# EAGLE schematic irwin (EAGLE 7.6.0)
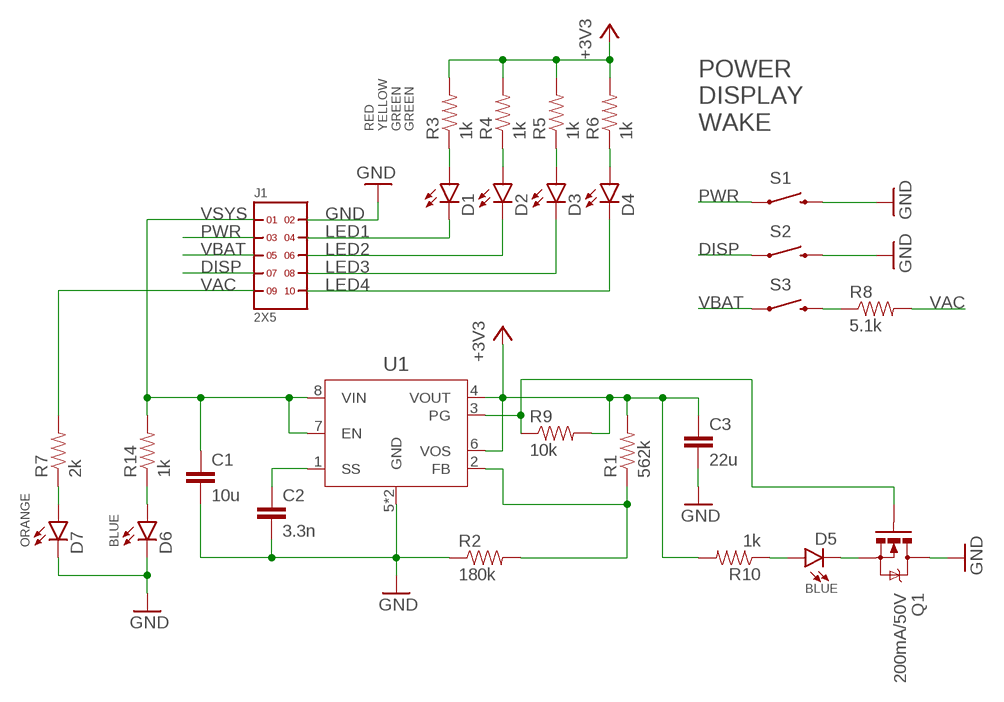
[diagram p0: schematic, sheet 1]

## Parts
C1  10u  CAP1206  [1206]
C2  3.3n  CAP1206  [1206]
C3  22u  CAP1206  [1206]
D1  LED1206  [LED-1206]
D2  LED1206  [LED-1206]
D3  LED1206  [LED-1206]
D4  LED1206  [LED-1206]
D5  LED1206  [LED-1206]
D6  LED1206  [LED-1206]
D7  LED1206  [LED-1206]
J1  2X5  [2X5]
Q1  200mA/50V  MOSFET-NCHANNELBSS138  [SOT23-3]
R1  562k  RESISTOR0805-RES  [0805]
R2  180k  RESISTOR0805-RES  [0805]
R3  1k  RESISTOR1206  [1206]
R4  1k  RESISTOR1206  [1206]
R5  1k  RESISTOR1206  [1206]
R6  1k  RESISTOR1206  [1206]
R7  2k  RESISTOR1206  [1206]
R8  5.1k  RESISTOR0805-RES  [0805]
R9  10k  RESISTOR0805-RES  [0805]
R10  1k  RESISTOR1206  [1206]
R14  1k  RESISTOR1206  [1206]
S1  SWITCH-MOMENTARY-2PTH  [TACTILE-PTH]
S2  SWITCH-MOMENTARY-2PTH  [TACTILE-PTH]
S3  SWITCH-MOMENTARY-2PTH  [TACTILE-PTH]
U1  LMZ21700SILR  [SIL0008B]

## Nets
+3V3: C3.1 R1.2 R3.2 R4.2 R5.2 R6.2 R9.2 R10.2 U1.4(VOUT) U1.6(VOS)
DISP: J1.7 S2.1
GND: C1.2 C2.2 C3.2 D6.C D7.C J1.2 Q1.3(D) R2.1 S1.3 S2.3 U1.5(GND) U1.9(GND)
LED1: D1.C J1.4
LED2: D2.C J1.6
LED3: D3.C J1.8
LED4: D4.C J1.10
N$1: C2.1 U1.1(SS)
N$2: R1.1 R2.2 U1.2(FB)
N$3: Q1.1(G) R9.1 U1.3(PG)
N$4: D1.A R3.1
N$5: D2.A R4.1
N$6: D3.A R5.1
N$7: D4.A R6.1
N$8: D7.A R7.1
N$9: D5.A R10.1
N$11: R8.1 S3.3
N$12: D5.C Q1.2(S)
N$14: D6.A R14.1
PWR: J1.3 S1.1
VAC: J1.9 R7.2 R8.2
VBAT: J1.5 S3.1
VSYS: C1.1 J1.1 R14.2 U1.7(EN) U1.8(VIN)

## Notes on the sheet
- RED
  YELLOW
  GREEN
  GREEN
- POWER
  DISPLAY
  WAKE
- ORANGE | BLUE
- BLUE

## Library data of the parts
C1-C3 = SparkFun-Capacitors:CAP: Capacitor Standard 0603 ceramic capacitor, and 0.1" leaded capacitor.
D1-D7 = SparkFun-LED:LED: LEDs Standard schematic elements and footprints for 5mm, 3mm, 1206, and 0603 sized LEDs. 5mm - Spark Fun Electronics SKU : COM-00529 (and others)
J1 = headers(2mm):2X5
Q1 = SparkFun-DiscreteSemi:MOSFET-NCHANNEL: Common NMOSFET Parts MFG P/N Store ID Prod ID FDD8780 TRANS-09984 SI7820DN TRANS-11055 FDS6630A IC-08089 2N7002PW TRANS-11151 FQP30N06L COM-10213 TRANS-10060 BSS123LT1G TRANS-08345 BSS138 TRANS-00830 BS170 2N7000; PROD_ID: TRANS-00830
R1-R10 R14 = SparkFun-Resistors:RESISTOR: Resistor Basic schematic elements and footprints for 0603, 1206, and PTH resistors.
S1-S3 = SparkFun-Electromechanical:SWITCH-MOMENTARY-2: Various NO switches- pushbuttons, reed, etc; PROD_ID: SWCH-08441
U1 = LMZ21700:LMZ21700SILR; DATASHEETURL: httpwww.ti.comproductlmz21700; FREQUENCY: 2500000.0; IMAX: 0.65; MANUFACTURER_NAME: Texas Instruments; MANUFACTURER_PART_NUMBER: LMZ21700SILR; MKTG_PACKAGE: SYB08A; NSID: LMZ21700SYBNOPB; PACKAGE: SYB08A; VENDOR: Texas Instruments